# Altium schematic sheet Pedal_Power.SchDoc
size A4; SheetNumber: 1; SheetTotal: 1
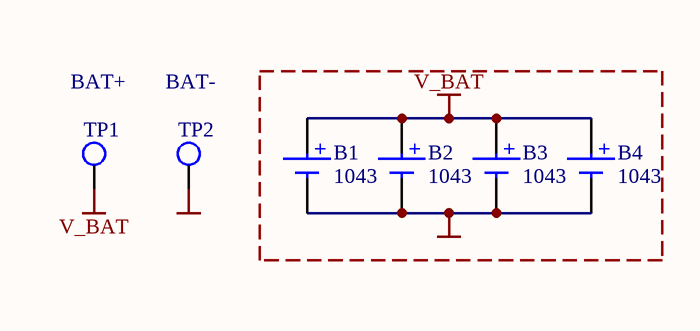
[diagram p0: Pedal_Power.SchDoc]

## Parts
B1  1043  [KEYSTONE 1043]
B2  1043  [KEYSTONE 1043]
B3  1043  [KEYSTONE 1043]
B4  1043  [KEYSTONE 1043]
TP1  BAT+  [TESTPOINT_PAD]
TP2  BAT-  [TESTPOINT_PAD]

## Nets
GND: B1.2(-) B2.2(-) B3.2(-) B4.2(-) TP2.1
V_BAT: B1.1(+) B2.1(+) B3.1(+) B4.1(+) TP1.1

## Library data of the parts
B1-B4 = 1043: BATTERY HOLDER 18650 PC PIN; Manufacturer: Keystone Electronics; Battery Cell Size: 18650; Battery Type, Function: Cylindrical, Holder; Number of Cells: 1; Style: Holder (Open); Part Number: 1043; ComponentLink1Description: Datasheet; ComponentLink1URL: http://keyelco.com/userAssets/file/M65p27.pdf; ComponentLink2Description: DigiKey Link; ComponentLink2URL: http://digikey.com/product-detail/en/keystone-electronics/1043/36-1043-ND/2745669; Height Above Board: 0.585" (14.86mm); LastUpdated: 2/2/2020 9:19:56 AM; Lifecycle Status: Active; Minimum Order: 1; Mounting Type: PCB, Through Hole; Operating Temperature: -50°C ~ 145°C; Packaging: Unknown; PartId: 2; Part Status: Active; Price: 2.58; Series: -; Supplier 1: DigiKey; Supplier Part Number 1: 36-1043-ND; Termination Style: PC Pin
TP1 TP2 = TestPoint: System: Connector